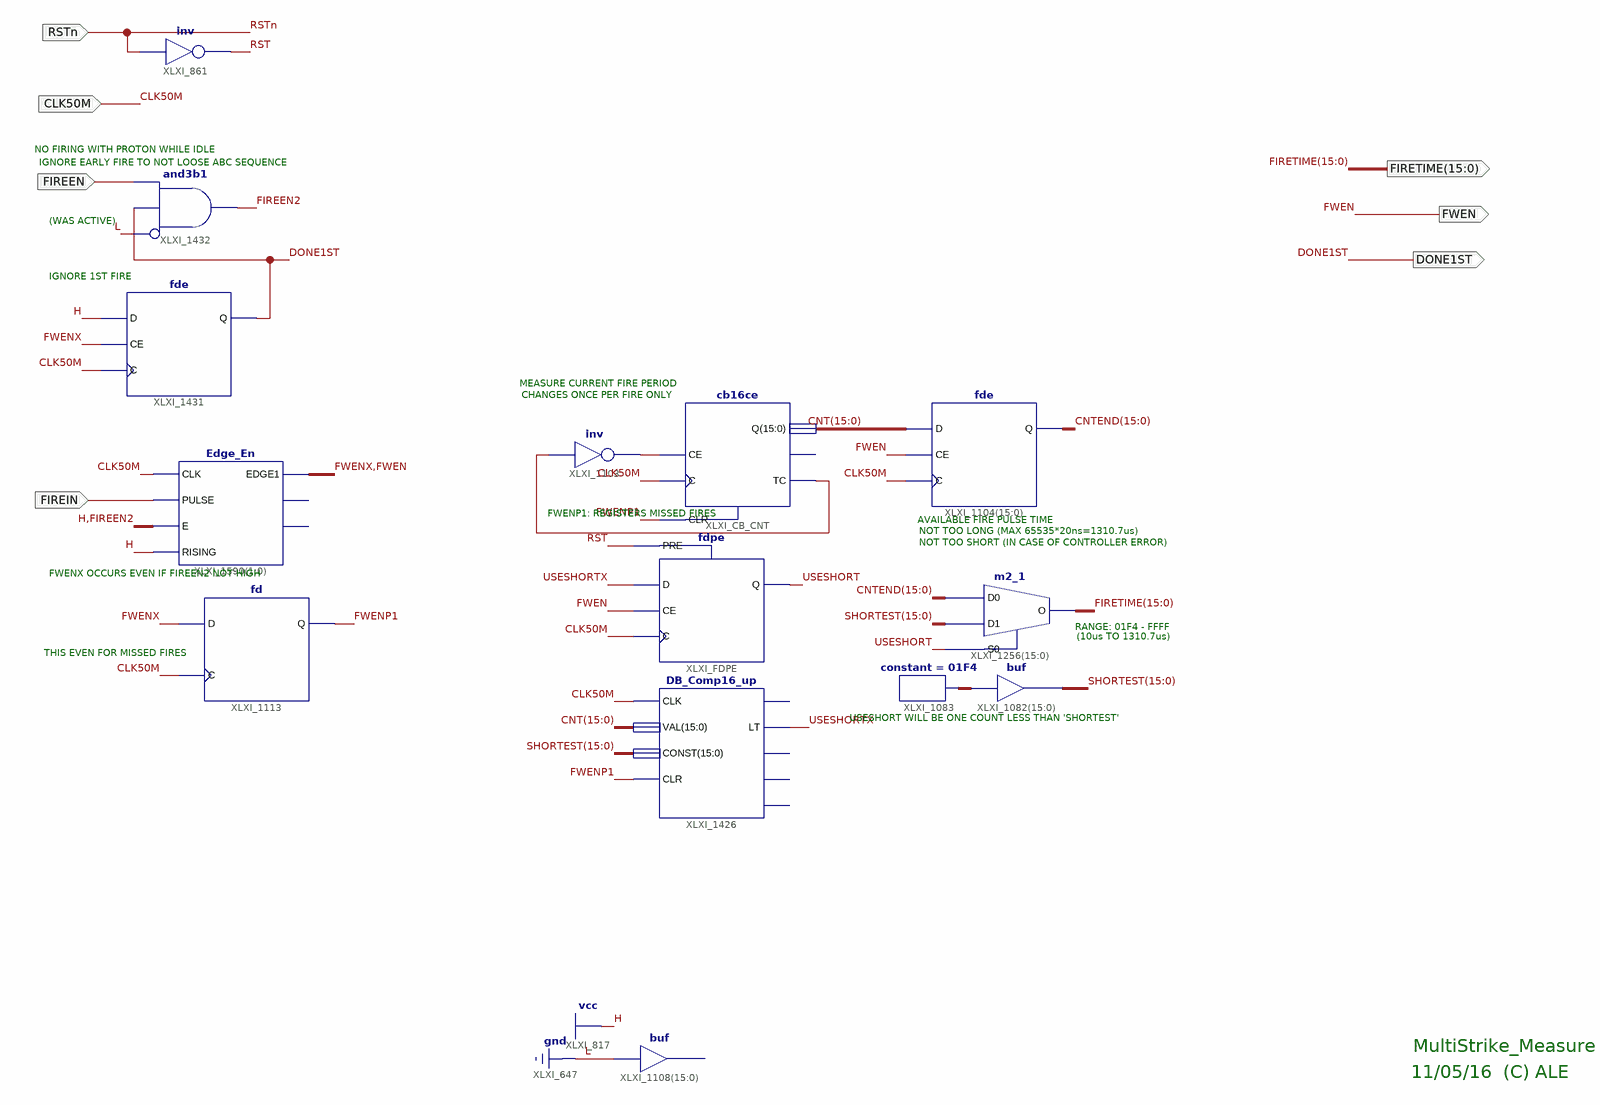
[diagram p0: schematic sheet 1]
// Xilinx ISE schematic DB_MultiStrike_Measure.sch (spartan3e) as structural Verilog: 14 symbols, 7 ports
module DB_MultiStrike_Measure (
  input  RSTn,
  input  CLK50M,
  input  FIREIN,
  input  FIREEN,
  output FWEN,
  output [15:0] FIRETIME,
  output DONE1ST
);

  wire FIREEN2, FWENP1, FWENX, RST, USESHORT, USESHORTX, XLXN_858, XLXN_895;
  wire [15:0] CNT, CNTEND, SHORTEST, XLXN_839;

  not XLXI_861 (RST, RSTn);
  // buf XLXI_1108[15..0] has open pins: I=1'b0, O=open
  cb16ce XLXI_CB_CNT (.C(CLK50M), .CE(XLXN_858), .CLR(FWENP1), .Q(CNT), .TC(XLXN_895));  // open: CEO
  not XLXI_1103 (XLXN_858, XLXN_895);
  fde XLXI_1104[15:0] (.C(CLK50M), .CE(FWEN), .D(CNT), .Q(CNTEND));
  assign SHORTEST = XLXN_839;  // buf XLXI_1082[15..0], 16 bits wide
  constant #(.CValue("01F4")) XLXI_1083 (.O(XLXN_839));
  DB_Comp16_up XLXI_1426 (
    .CLK(CLK50M), .CLR(FWENP1), .CONST(SHORTEST), .LT(USESHORTX), .VAL(CNT));  // open: EQ, GE, GT, LE
  fdpe XLXI_FDPE (.C(CLK50M), .CE(FWEN), .D(USESHORTX), .PRE(RST), .Q(USESHORT));
  m2_1 XLXI_1256[15:0] (.D0(CNTEND), .D1(SHORTEST), .S0(USESHORT), .O(FIRETIME));
  fd XLXI_1113 (.C(CLK50M), .D(FWENX), .Q(FWENP1));
  Edge_En XLXI_1590[1:0] (
    .CLK(CLK50M), .E({1'b1, FIREEN2}), .EDGE1({FWENX, FWEN}), .PULSE(FIREIN), .RISING(1'b1));  // open: EDGE0, EDGEQUICK
  and XLXI_1432 (FIREEN2, ~1'b0, DONE1ST, FIREEN);  // and3b1
  fde XLXI_1431 (.C(CLK50M), .CE(FWENX), .D(1'b1), .Q(DONE1ST));

  // Notes on the sheet:
  //   NO FIRING WITH PROTON WHILE IDLE
  //   IGNORE EARLY FIRE TO NOT LOOSE ABC SEQUENCE
  //   (WAS ACTIVE)
  //   IGNORE 1ST FIRE
  //   MEASURE CURRENT FIRE PERIOD
  //   CHANGES ONCE PER FIRE ONLY
  //   FWENP1: REGISTERS MISSED FIRES
  //   AVAILABLE FIRE PULSE TIME
  //   NOT TOO LONG (MAX 65535*20ns=1310.7us)
  //   NOT TOO SHORT (IN CASE OF CONTROLLER ERROR)
  //   FWENX OCCURS EVEN IF FIREEN2 NOT HIGH
  //   RANGE: 01F4 - FFFF
  //   (10us TO 1310.7us)
  //   THIS EVEN FOR MISSED FIRES
  //   USESHORT WILL BE ONE COUNT LESS THAN 'SHORTEST'
  //   MultiStrike_Measure
  //   11/05/16  (C) ALE
endmodule
